# EAGLE design sparkfun-nrf52832-breakout (EAGLE 7.7.0)
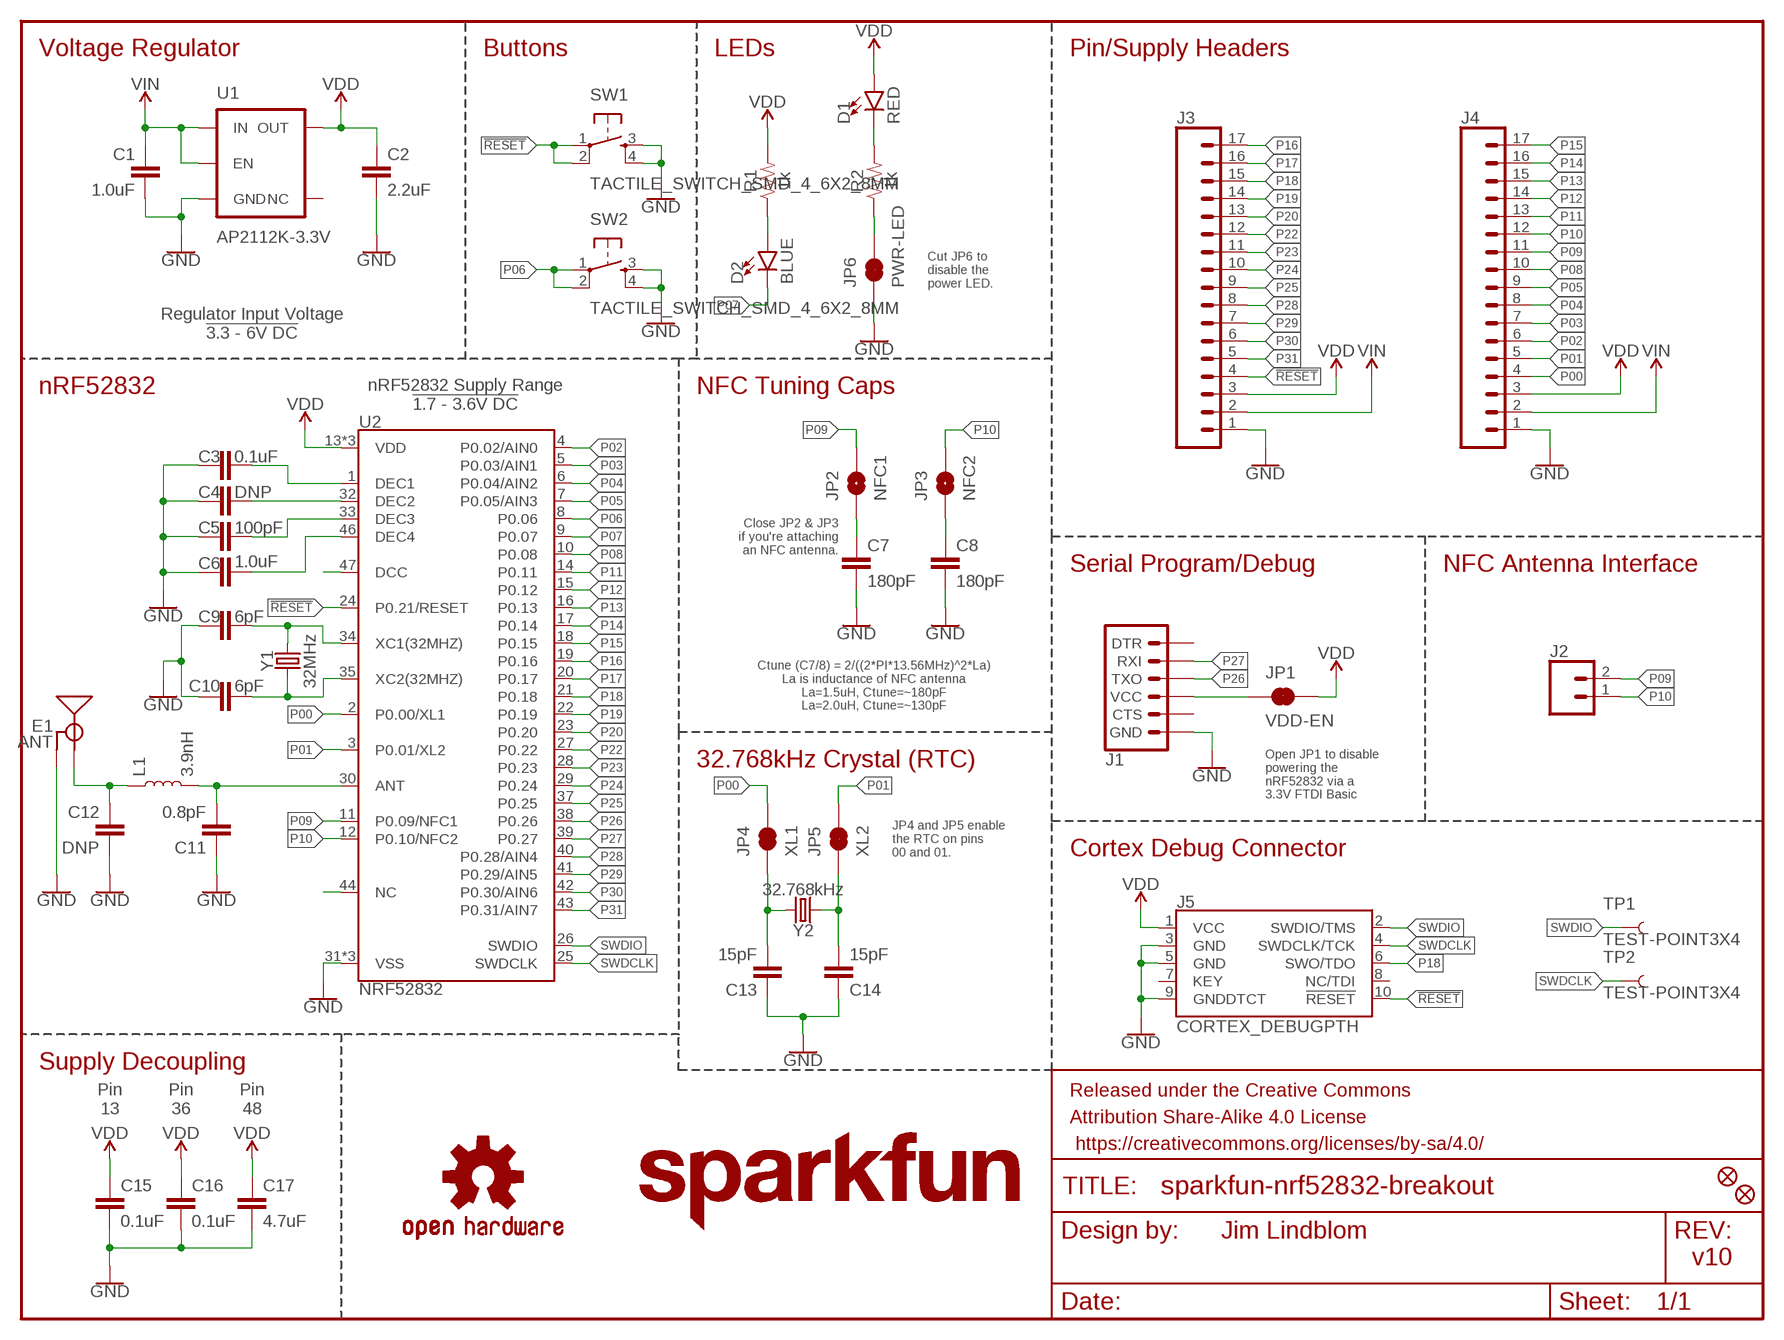
[diagram p0: schematic, sheet 1]

## Parts
C1  1.0uF  1.0UF-0603-16V-10%  [0603]
C2  2.2uF  2.2UF-0603-10V-20%  [0603]
C3  0.1uF  0.1UF-0402-16V-10%  [0402]
C4  DNP  CAP0402  [0402]
C5  100pF  100PF-0402-50V-5%  [0402]
C6  1.0uF  1.0UF-0402-16V-10%  [0402]
C7  180pF  180PF-0603-50V-5%  [0603]
C8  180pF  180PF-0603-50V-5%  [0603]
C9  6pF  6PF-0402-50V-0.5%  [0402]
C10  6pF  6PF-0402-50V-0.5%  [0402]
C11  0.8pF  0.8PF-0402-50V-0.1PF  [0402]
C12  DNP  CAP0402  [0402]
C13  15pF  15PF-0402-50V-5%  [0402]
C14  15pF  15PF-0402-50V-5%  [0402]
C15  0.1uF  0.1UF-0402-16V-10%  [0402]
C16  0.1uF  0.1UF-0402-16V-10%  [0402]
C17  4.7uF  4.7UF0603  [0603]
D1  RED  LED-RED0603  [LED-0603]
D2  BLUE  LED-BLUE0603  [LED-0603]
E1  ANT  ANTENNA-GROUNDEDTRACE-15.2MM  [TRACE_ANTENNA_2.4GHZ_15.2MM]
FD1  FIDUCIALUFIDUCIAL  [FIDUCIAL-MICRO]
FD2  FIDUCIALUFIDUCIAL  [FIDUCIAL-MICRO]
FRAME1  FRAME-LETTER  [CREATIVE_COMMONS]
J1  ARDUINO_SERIAL_PROGRAMPTH  [1X06]
J2  CONN_02PTH  [1X02]
J3  CONN_17  [1X17]
J4  CONN_17  [1X17]
J5  CORTEX_DEBUGPTH  [2X5-PTH-1.27MM]
JP1  VDD-EN  JUMPER-SMT_2_NC_TRACE_SILK  [SMT-JUMPER_2_NC_TRACE_SILK]
JP2  NFC1  JUMPER-SMT_2_NO_SILK  [SMT-JUMPER_2_NO_SILK]
JP3  NFC2  JUMPER-SMT_2_NO_SILK  [SMT-JUMPER_2_NO_SILK]
JP4  XL1  JUMPER-PAD-2-NC_BY_TRACE  [PAD-JUMPER-2-NC_BY_TRACE_YES_SILK]
JP5  XL2  JUMPER-PAD-2-NC_BY_TRACE  [PAD-JUMPER-2-NC_BY_TRACE_YES_SILK]
JP6  PWR-LED  JUMPER-PAD-2-NC_BY_TRACE  [PAD-JUMPER-2-NC_BY_TRACE_YES_SILK]
L1  3.9nH  INDUCTOR-0402-3.9NH  [0402]
LOGO1  OSHW-LOGOMINI  [OSHW-LOGO-MINI]
LOGO2  SFE_LOGO_NAME.1_INCH  [SFE_LOGO_NAME_.1]
LOGO3  SFE_LOGO_NAME.1_INCH  [SFE_LOGO_NAME_.1]
R1  1k  1KOHM-0603-1/10W-1%  [0603]
R2  1k  1KOHM-0603-1/10W-1%  [0603]
SW1  TACTILE_SWITCH_SMD_4_6X2_8MM  SWITCH_SPST_4_PINRECT  [TACTILE_SWITCH_SMD_4.6X2.8MM]
SW2  TACTILE_SWITCH_SMD_4_6X2_8MM  SWITCH_SPST_4_PINRECT  [TACTILE_SWITCH_SMD_4.6X2.8MM]
TP1  TEST-POINT3X4  [PAD.03X.04]
TP2  TEST-POINT3X4  [PAD.03X.04]
U1  AP2112K-3.3V  V_REG_AP2112K-3.3V  [SOT23-5]
U2  NRF52832  [QFN48-6X6MM]
Y1  32MHz  CRYSTAL-32MHZ-SMD-2.0X1.6MM  [CRYSTAL-SMD-2.0X1.6MM]
Y2  32.768kHz  CRYSTAL-32.768KHZSMD-3.2X1.5  [CRYSTAL-SMD-3.2X1.5MM]

## Nets
!RESET!: J3.4 J5.10(!RESET) SW1.1 SW1.2 U2.24(P0.21/RESET)
ANT: C11.2 L1.2 U2.30(ANT)
DCC: U2.47(DCC)
DEC1: C3.2 U2.1(DEC1)
DEC2: C4.2 U2.32(DEC2)
DEC3: C5.2 U2.33(DEC3)
DEC4: C6.2 U2.46(DEC4)
GND: C1.2 C2.2 C3.1 C4.1 C5.1 C6.1 C7.2 C8.2 C9.1 C10.2 C11.1 C12.2 C13.1 C14.1 C15.2 C16.2 C17.2 E1.GND J1.6(GND) J3.1 J4.1 J5.3(GND) J5.5(GND) J5.9(GNDDTCT) JP6.1 SW1.3 SW1.4 SW2.3 SW2.4 U1.2(GND) U2.31(VSS) U2.45(VSS) U2.EP(VSS)
N$1: JP6.2 R2.1
N$3: C13.2 JP4.1 Y2.P$2
N$4: C14.2 JP5.1 Y2.P$1
N$11: C12.1 E1.ANT(SIGNAL) L1.1
N$12: D1.C R2.2
N$14: J1.4(VCC) JP1.1
N$15: D2.A R1.1
NC: U2.44(NC)
NFC1: C7.1 JP2.1
NFC2: C8.1 JP3.1
P00: J4.4 JP4.2 U2.2(P0.00/XL1)
P01: J4.5 JP5.2 U2.3(P0.01/XL2)
P02: J4.6 U2.4(P0.02/AIN0)
P03: J4.7 U2.5(P0.03/AIN1)
P04: J4.8 U2.6(P0.04/AIN2)
P05: J4.9 U2.7(P0.05/AIN3)
P06: SW2.1 SW2.2 U2.8(P0.06)
P07: D2.C U2.9(P0.07)
P08: J4.10 U2.10(P0.08)
P09: J2.2 J4.11 JP2.2 U2.11(P0.09/NFC1)
P10: J2.1 J4.12 JP3.2 U2.12(P0.10/NFC2)
P11: J4.13 U2.14(P0.11)
P12: J4.14 U2.15(P0.12)
P13: J4.15 U2.16(P0.13)
P14: J4.16 U2.17(P0.14)
P15: J4.17 U2.18(P0.15)
P16: J3.17 U2.19(P0.16)
P17: J3.16 U2.20(P0.17)
P18: J3.15 J5.6(SWO/TDO) U2.21(P0.18)
P19: J3.14 U2.22(P0.19)
P20: J3.13 U2.23(P0.20)
P22: J3.12 U2.27(P0.22)
P23: J3.11 U2.28(P0.23)
P24: J3.10 U2.29(P0.24)
P25: J3.9 U2.37(P0.25)
P26: J1.3(TXO) U2.38(P0.26)
P27: J1.2(RXI) U2.39(P0.27)
P28: J3.8 U2.40(P0.28/AIN4)
P29: J3.7 U2.41(P0.29/AIN5)
P30: J3.6 U2.42(P0.30/AIN6)
P31: J3.5 U2.43(P0.31/AIN7)
SWDCLK: J5.4(SWDCLK/TCK) TP2.P$1 U2.25(SWDCLK)
SWDIO: J5.2(SWDIO/TMS) TP1.P$1 U2.26(SWDIO)
VDD: C2.1 C15.1 C16.1 C17.1 D1.A J3.3 J4.3 J5.1(VCC) JP1.2 R1.2 U1.5(OUT) U2.13(VDD) U2.36(VDD) U2.48(VDD)
VIN: C1.1 J3.2 J4.2 U1.1(IN) U1.3(EN)
XC1: C9.2 U2.34(XC1(32MHZ)) Y1.3
XC2: C10.1 U2.35(XC2(32MHZ)) Y1.1
Unconnected: J1.1(DTR) J1.5(CTS) J5.7(KEY) J5.8(NC/TDI) U1.4(NC)

## Notes on the sheet
- Voltage Regulator | Buttons | LEDs | Pin/Supply Headers
- Cut JP6 to
  disable the
  power LED.
- Regulator Input Voltage
  !3.3 - 6V DC!
- nRF52832
- nRF52832 Supply Range
  !1.7 - 3.6V DC!
- NFC Tuning Caps
- Close JP2 & JP3
  if you're attaching
  an NFC antenna.
- Serial Program/Debug | NFC Antenna Interface
- Ctune (C7/8) = 2/((2*PI*13.56MHz)^2*La)
  La is inductance of NFC antenna
  La=1.5uH, Ctune=~180pF
  La=2.0uH, Ctune=~130pF
- Open JP1 to disable 
  powering the 
  nRF52832 via a
  3.3V FTDI Basic
- 32.768kHz Crystal (RTC)
- JP4 and JP5 enable
  the RTC on pins
  00 and 01.
- Cortex Debug Connector
- Supply Decoupling
- Pin
  13
- Pin
  36
- Pin
  48
- Jim Lindblom
- v10

## Library data of the parts
C1 = SparkFun-Capacitors:1.0UF: 1µF ceramic capacitors A capacitor is a passive two-terminal electrical component used to store electrical energy temporarily in an electric field.; PROD_ID: CAP-00868
C2 = SparkFun-Capacitors:2.2UF: 2.2µF ceramic capacitors A capacitor is a passive two-terminal electrical component used to store electrical energy temporarily in an electric field.; PROD_ID: CAP-07888
C3 C15 C16 = SparkFun-Capacitors:0.1UF: 0.1µF ceramic capacitors A capacitor is a passive two-terminal electrical component used to store electrical energy temporarily in an electric field.; PROD_ID: CAP-12416
C4 C12 = SparkFun-Passives:CAP: Capacitor Standard 0603 ceramic capacitor, and 0.1" leaded capacitor.
C5 = nrf52832-breakout-temp:100PF: 100pF/0.1nF ceramic capacitors A capacitor is a passive two-terminal electrical component used to store electrical energy temporarily in an electric field.; PROD_ID: CAP-13458
C6 = SparkFun-Capacitors:1.0UF: 1µF ceramic capacitors A capacitor is a passive two-terminal electrical component used to store electrical energy temporarily in an electric field.; PROD_ID: CAP-12417
C7 C8 = nrf52832-breakout-temp:180PF: 180pF/0.18nF ceramic capacitors A capacitor is a passive two-terminal electrical component used to store electrical energy temporarily in an electric field.; PROD_ID: CAP-11661
C9 C10 = nrf52832-breakout-temp:6PF: 15pF ceramic capacitors A capacitor is a passive two-terminal electrical component used to store electrical energy temporarily in an electric field.; PROD_ID: CAP-13455
C11 = nrf52832-breakout-temp:0.8PF: 0.8pF ceramic capacitors A capacitor is a passive two-terminal electrical component used to store electrical energy temporarily in an electric field.; PROD_ID: CAP-13456
C13 C14 = SparkFun-Capacitors:15PF: 15pF ceramic capacitors A capacitor is a passive two-terminal electrical component used to store electrical energy temporarily in an electric field.; PROD_ID: CAP-13063
C17 = SparkFun-Capacitors:4.7UF: 4.7µF ceramic capacitors A capacitor is a passive two-terminal electrical component used to store electrical energy temporarily in an electric field.; PROD_ID: CAP-08280
D1 = SparkFun-LED:LED-RED: Red SMD LED Used in manufacturing of most products at SparkFun Packages: 0603 - SMD 0603 package [Product Link] <http://docs.avagotech.com/docs/AV02-0551EN> 0603 SMART - SMD 0603 SMART package ( more efficient and expensive)[Product Link] <http://www.osram-os.com/Graphics/XPic2/00077099_0.pdf> 1206 - SMD1206 package [Product Link] <https://www.sparkfun.com/datasheets/DevTools/LilyPad/Q150OVS4.pdff> SparkFun Products: Pro Mini 328 -5V <https://www.sparkfun.com/products/821> RedBoard <https://www.sparkfun.com/products/12757> IOIO-OTG <https://www.sparkfun.com/products/13613>; PROD_ID: DIO-00819
D2 = SparkFun-LED:LED-BLUE: Blue SMD LED Used in manufacturing of various products at SparkFun Packages: 0603 - SMD 0603 package [Product Link] <http://www.digikey.com/product-detail/en/SMLE12BC7TT86/511-1589-2-ND/1641808> 1206 - SMD1206 package [Product Link] <http://www.digikey.com/product-detail/en/lite-on-inc/LTST-C150TBKT/160-1643-1-ND/573584> SparkFun Products: ESP8266 Thing-Dev Board <https://www.sparkfun.com/products/13711> RedBoard <https://www.sparkfun.com/products/12757>; PROD_ID: DIO-08575
E1 = SparkFun-RF:ANTENNA-GROUNDED: Antenna w/ Ground Connection 2.4GHz antennae with signal and ground terminals. TRACE_ANTENNA_2.4GHZ_15.2MM - Meander Trace antenna 15.2 x 5.7mm footprint Based on layout from TI app note AN043 <http://www.ti.com/lit/an/swra117d/swra117d.pdf>. TRACE_ANTENNA_2.4GHZ_25.7MM - Inverted F trace antenna 25.7 x 7.5 mm footprint. Based on layout from TI design note DN0007 <http://www.ti.com/lit/an/swru120b/swru120b.pdf>.
FD1 FD2 = SparkFun-Aesthetics:FIDUCIAL: Fiducial Alignment Points Point-of-reference for pick-and-place machines and other optical instruments.
FRAME1 = SparkFun-Aesthetics:FRAME-LETTER: Schematic Frame Standard 8.5x11 US Letter frame
J1 = SparkFun-Connectors:ARDUINO_SERIAL_PROGRAM: FTDI connector footprints
J2 = SparkFun-Connectors:CONN_02: Multi connection point. Often used as Generic Header-pin footprint for 0.1 inch spaced/style header connections On any of the 0.1 inch spaced packages, you can populate with these: Break Away Headers - Straight <https://www.sparkfun.com/products/116> (PRT-00116) Break Away Male Headers - Right Angle <https://www.sparkfun.com/products/553> (PRT-00553) Female Headers <https://www.sparkfun.com/products/115> (PRT-00115) Break Away Headers - Machine Pin <https://www.sparkfun.com/products/117> (PRT-00117) Break Away Female Headers - Swiss Machine Pin <https://www.sparkfun.com/products/743> (PRT-00743) For SCREWTERMINALS and SPRING TERMINALS visit here: Screw Terimnals on SparkFun.com <https://www.sparkfun.com/search/results?term=Screw+Terminals> (5mm/3.5mm/2.54mm spacing) This device is also useful as a general connection point to wire up your design to another part of your project. Our various solder wires solder well into these plated through hole pads. Hook-Up Wire - Assortment (Stranded, 22 AWG) <https://www.sparkfun.com/products/11375> (PRT-11375) Hook-Up Wire - Assortment (Solid Core, 22 AWG) <https://www.sparkfun.com/products/11367> (PRT-11367) View the entire wire category on our website here <https://www.sparkfun.com/categories/141> Special notes: Molex polarized connector foot print use with: PRT-08233 with associated crimp pins and housings. 2.54_SCREWTERM for use with PRT-10571. 3.5mm Screw Terminal footprints for PRT-08084 5mm Screw Terminal footprints for use with PRT-08432
J3 J4 = SparkFun-Connectors:CONN_17: 1x17 .1" header
J5 = SparkFun-Connectors:CORTEX_DEBUG: Cortex Debug Connector Datasheet <http://infocenter.arm.com/help/topic/com.arm.doc.faqs/attached/13634/cortex_debug_connectors.pdf>
JP1 = SparkFun-Jumpers:JUMPER-SMT_2_NC_TRACE: Normally closed trace jumper This jumper has a trace between two pads so it's normally closed (NC). Use a razor knife to open the connection. For best results follow the IPC guidelines for cutting traces: Cutout at least 0.063 mm (0.005 in). Remove all loose material to clean up the cut area. Seal the cut with an approved epoxy. Reapply solder to reclose the connection.
JP2 JP3 = SparkFun-Jumpers:JUMPER-SMT_2_NO: Normally open jumper This jumper has two pads in close proximity to each other. Apply solder to close the connection. Round pads are easier to solder for beginners, but are a lot larger. SparkFun Product that uses the round pads: SparkFun EL Sequencer <https://www.sparkfun.com/products/12781>
JP4-JP6 = SparkFun-Jumpers:JUMPER-PAD-2-NC_BY_TRACE
L1 = nrf52832-breakout-temp:INDUCTOR: Inductors Resist changes in electrical current. Basically a coil of wire. SparkFun Products: SparkFun Load Cell Amplifier - HX711 <https://www.sparkfun.com/products/13879> IOIO-OTG - V2.2 <https://www.sparkfun.com/products/13613>; PROD_ID: NDUC-13457
LOGO1 = SparkFun-Aesthetics:OSHW-LOGO: Open-Source Hardware (OSHW) Logo This logo indicates the piece of hardware it is found on incorporates a OSHW license and/or adheres to the definition of open source hardware found here: http://freedomdefined.org/OSHW
LOGO2 LOGO3 = SparkFun-Aesthetics:SFE_LOGO_NAME: SparkFun Font Logo This is the SparkFun name logo. The logo on the schematic will always be the same size; the package variant is the height of the flame part of the logo (or the height the flame would be, if it were drawn). Default layer for the logo on the board is tSilk.
R1 R2 = SparkFun-Resistors:1KOHM: 1kΩ resistor A resistor is a passive two-terminal electrical component that implements electrical resistance as a circuit element. Resistors act to reduce current flow, and, at the same time, act to lower voltage levels within circuits.; PROD_ID: RES-07856
SW1 SW2 = SparkFun-Electromechanical:SWITCH_SPST_4_PIN; PROD_ID: SWCH-13065
TP1 TP2 = SparkFun-Connectors:TEST-POINT: Bare copper test points for troubleshooting or ICT
U1 = SparkFun-PowerIC:V_REG_AP2112: AP2112 - 600mA CMOS LDO Regulator w/ Enable The AP2112 is CMOS process low dropout linear regulator with enable function, the regulator delivers a guaranteed 600mA (min.) continuous load current. Features Output Voltage Accuracy: ±1.5% Output Current: 600mA (Min.) Foldback Short Current Protection: 50mA Enable Function to Turn ON/OFF VOUT Low Dropout Voltage (3.3V): 250mV (Typ.) @IOUT=600mA Excellent Load Regulation: 0.2%/A (Typ.) Excellent Line Regulation: 0.02%/V (Typ.) Low Quiescent Current: 55μA (Typ.) Low Standby Current: 0.01μA (Typ.) Low Output Noise: 50μVRMS PSRR: 100Hz -65dB, 1kHz -65dB OTSD Protection Stable with 1.0μF Flexible Cap: Ceramic, Tantalum and Aluminum Electrolytic Operation Temperature Range: -40°C to 85°C ESD: MM 400V, HBM 4000V; PROD_ID: VREG-12457; VALUE: 3.3V
U2 = nrf52832-breakout-temp:NRF52832: Nordic nRF52832 Bluetooth Smart/ANT/2.4GHz RF SoC The nRF52832 SoC is a powerful, highly flexible ultra-low power multiprotocol SoC ideally suited for Bluetooth® Smart ANT and 2.4GHz ultra low-power wireless applications. The nRF52832 SoC is built around a 32-bit ARM® Cortex™-M4F CPU with 512kB + 64kB RAM. The embedded 2.4GHz transceiver supports Bluetooth Smart, ANT and proprietary 2.4 GHz protocol stack. It is on air compatible with the nRF51 Series, nRF24L and nRF24AP Series products from Nordic Semiconductor. Product Page <https://www.nordicsemi.com/eng/Products/Bluetooth-low-energy2/nRF52832>; PROD_ID: IC-13460
Y1 = nrf52832-breakout-temp:CRYSTAL-32MHZ: 32MHz Crystal Digikey Example <http://www.digikey.com/product-detail/en/murata-electronics-north-america/XRCGB32M000F2P00R0/490-9769-1-ND/4952013> Frequency: 32MHz Frequency Stability: ±20ppm Frequency Tolerance: ±20ppm Load Capacitance: 6pF; PROD_ID: XTAL-13459
Y2 = SparkFun-Clocks:CRYSTAL-32.768KHZ: 32.768kHz Crystal Frequency: 32.768kHz Frequency Stability: ±20ppm Load Capacitance: 12.5pF (PTH-2X6 & SMD-3.2X1.5), 6pF (SMD-2X6); PROD_ID: XTAL-13062

## Board
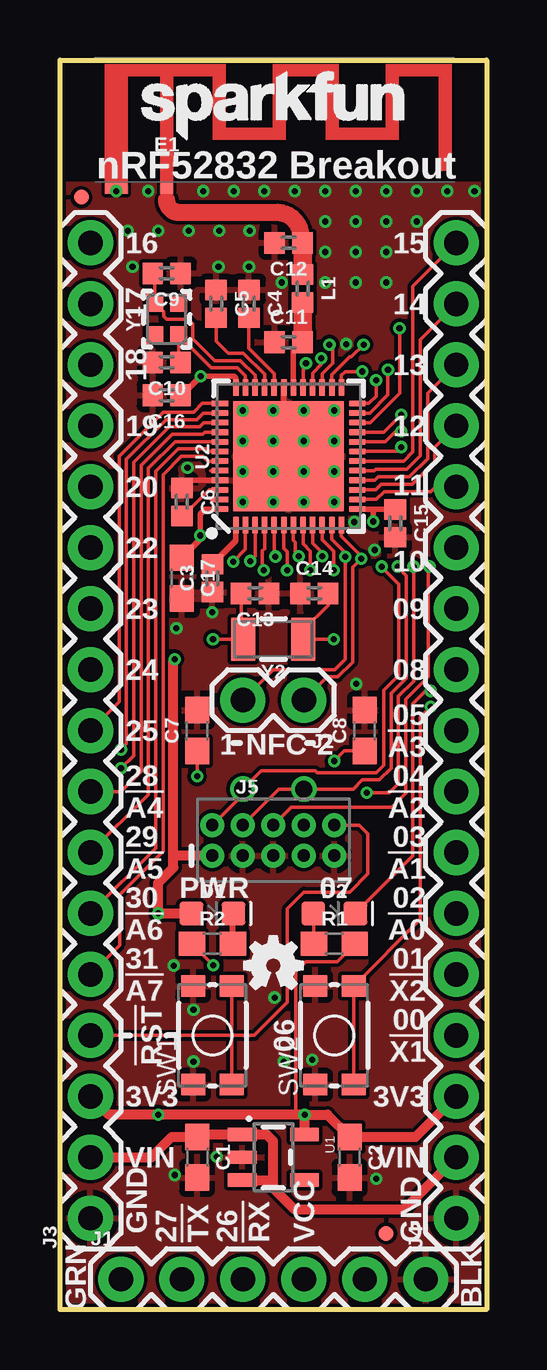
[diagram p1: board, top side]
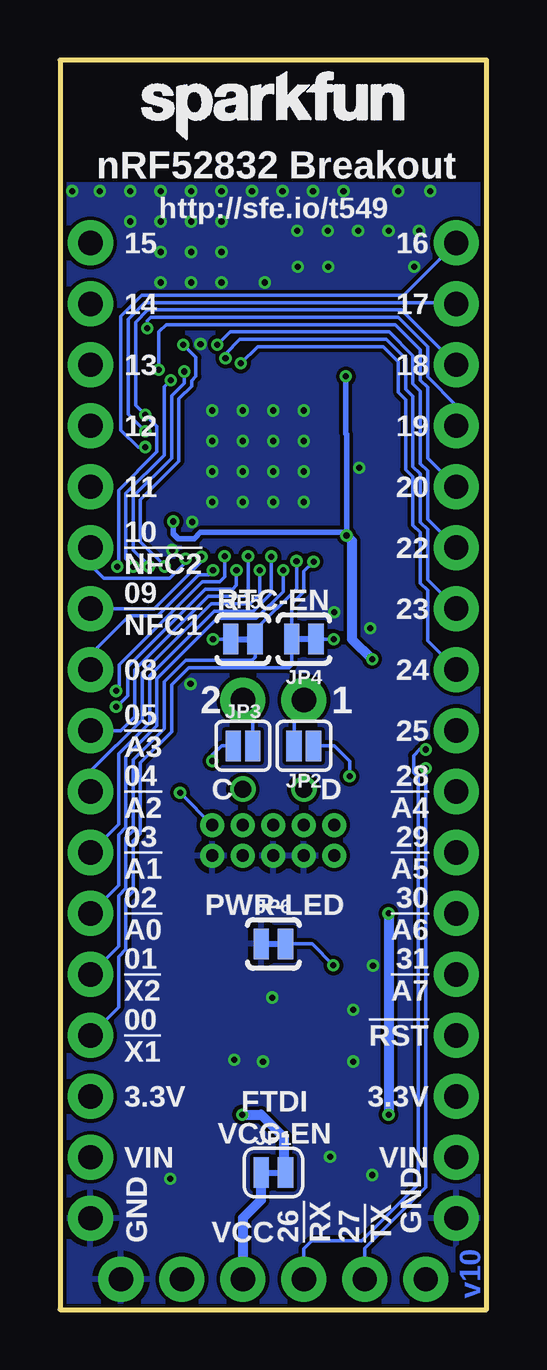
[diagram p2: board, bottom side, seen from below]

Size 17.78 x 52.07 mm. Coordinates in mm from the lower left corner, seen from the top.
Outline: 0,0 0,52.07 17.78,52.07 17.78,0 0,0
Copper layers (1*16): Top 0.035mm / dielectric 1.5mm / Bottom 0.035mm
Design rules "SparkFun-2-layer-FAB-LIMIT *": minimum track width 4mil, minimum drill 6mil, track to track 6mil, track to pad 6mil, pad to pad 6mil, via to via 6mil, smd to smd 6mil, copper to edge 4mil, drill to drill 4mil, minimum pad ring 5mil, minimum via ring 5mil, stop-mask expansion 4mil, vias tented up to drill 25mil, thermal gap 10mil
tRestrict: 2 lines

### Footprints (pad centres in the part's own frame; a part is rotated, then mirrored left to right if it is on the bottom)
0603 = smd 1.1 x 1: 1 -0.85,0; 2 0.85,0
0402 = smd 0.85 x 0.9: 1 -0.58,0; 2 0.58,0
LED-0603 = smd 1 x 1: A -0.877,0; C 0.877,0
TRACE_ANTENNA_2.4GHZ_15.2MM = smd 0.5 x 0.5: ANT 0,-0.25 | smd 0.9 x 0.5: GND -2.1,-0.25
FIDUCIAL-MICRO = smd 0.635 x 0.635: 1 0,0
1X06 = drill 1.016 pad 1.88: 1 0,0; 2 2.54,0; 3 5.08,0; 4 7.62,0; 5 10.16,0; 6 12.7,0
1X02 = drill 1.016 pad 1.88: 1 0,0; 2 2.54,0
1X17 = drill 1.016 pad 1.88: 1 0,0; 2 2.54,0; 3 5.08,0; 4 7.62,0; 5 10.16,0; 6 12.7,0; 7 15.24,0; 8 17.78,0; 9 20.32,0; 10 22.86,0; 11 25.4,0; 12 27.94,0; 13 30.48,0; 14 33.02,0; 15 35.56,0; 16 38.1,0; 17 40.64,0
2X5-PTH-1.27MM = drill 0.508 pad 1: 1 -2.54,-0.635; 2 -2.54,0.635; 3 -1.27,-0.635; 4 -1.27,0.635; 5 0,-0.635; 6 0,0.635; 7 1.27,-0.635; 8 1.27,0.635; 9 2.54,-0.635; 10 2.54,0.635
SMT-JUMPER_2_NC_TRACE_SILK = smd 0.635 x 1.27: 1 -0.508,0; 2 0.508,0
SMT-JUMPER_2_NO_SILK = smd 0.635 x 1.27: 1 -0.406,0; 2 0.406,0
PAD-JUMPER-2-NC_BY_TRACE_YES_SILK = smd 0.635 x 1.27: 1 -0.508,0; 2 0.508,0
TACTILE_SWITCH_SMD_4.6X2.8MM = smd 0.9 x 1: 1 -2.05,-0.8; 2 2.05,-0.8; 3 2.05,0.8; 4 -2.05,0.8
PAD.03X.04 = smd 1.016 x 1.016: P$1 0,0
SOT23-5 = smd 0.55 x 1.2: 1 -0.95,-1.3; 2 0,-1.3; 3 0.95,-1.3; 4 0.95,1.3; 5 -0.95,1.3
QFN48-6X6MM = smd 0.68 x 0.23: 1 -2.86,2.2; 2 -2.86,1.8; 3 -2.86,1.4; 4 -2.86,1; 5 -2.86,0.6; 6 -2.86,0.2; 7 -2.86,-0.2; 8 -2.86,-0.6; 9 -2.86,-1; 10 -2.86,-1.4; 11 -2.86,-1.8; 12 -2.86,-2.2; 25 2.86,-2.2; 26 2.86,-1.8; 27 2.86,-1.4; 28 2.86,-1; 29 2.86,-0.6; 30 2.86,-0.2; 31 2.86,0.2; 32 2.86,0.6; 33 2.86,1; 34 2.86,1.4; 35 2.86,1.8; 36 2.86,2.2 | smd 0.23 x 0.68: 13 -2.2,-2.86; 14 -1.8,-2.86; 15 -1.4,-2.86; 16 -1,-2.86; 17 -0.6,-2.86; 18 -0.2,-2.86; 19 0.2,-2.86; 20 0.6,-2.86; 21 1,-2.86; 22 1.4,-2.86; 23 1.8,-2.86; 24 2.2,-2.86; 37 2.2,2.86; 38 1.8,2.86; 39 1.4,2.86; 40 1,2.86; 41 0.6,2.86; 42 0.2,2.86; 43 -0.2,2.86; 44 -0.6,2.86; 45 -1,2.86; 46 -1.4,2.86; 47 -1.8,2.86; 48 -2.2,2.86 | smd 4.6 x 4.6: EP 0,0
CRYSTAL-SMD-2.0X1.6MM = smd 0.75 x 0.7: 1 -0.675,-0.5; 2 0.675,-0.5; 3 0.675,0.5; 4 -0.675,0.5
CRYSTAL-SMD-3.2X1.5MM = smd 1 x 1.8: P$1 -1.25,0; P$2 1.25,0

### Placement (x,y rotation side)
C1  5.71,6.35 270 top
C2  12.06,6.35 270 top
C3  6.35,30.48 90 top
C4  7.87,41.91 270 top
C5  6.5,41.91 270 top
C6  5.08,33.66 270 top
C7  5.71,24.13 90 top
C8  12.7,24.13 90 top
C9  4.45,43.18 180 top
C10  4.45,39.47 180 top
C11  9.53,40.31 0 top
C12  9.53,44.45 180 top
C13  8.13,29.84 180 top
C14  10.59,29.84 0 top
C15  13.97,32.77 270 top
C16  4.45,38.1 180 top
C17  5.08,30.48 270 top
D1  6.35,16.51 0 top
D2  11.43,16.51 0 top
E1  4.45,46.99 0 top
FD1  13.59,3.17 0 top
FD2  0.89,46.35 0 top
FRAME1  -10.16,-17.78 0 top  (outside the outline)
J1  2.54,1.27 0 top
J2  10.16,25.4 180 top
J3  1.27,3.81 90 top
J4  16.51,3.81 90 top
J5  8.89,19.56 0 top
JP1  8.89,5.71 0 bottom
JP2  7.62,23.5 180 bottom
JP3  10.16,23.5 0 bottom
JP4  7.62,27.94 180 bottom
JP5  10.16,27.94 0 bottom
JP6  8.89,15.24 0 bottom
L1  10.11,42.55 270 top
LOGO1  8.89,14.35 0 top
LOGO2  2.92,48.26 0 top
LOGO3  14.86,48.26 0 bottom
R1  11.43,15.24 0 top
R2  6.35,15.24 0 top
SW1  6.35,11.43 90 top
SW2  11.43,11.43 90 top
TP1  7.62,21.69 0 bottom
TP2  10.16,21.69 0 bottom
U1  8.89,6.35 270 top
U2  9.53,35.56 90 top
Y1  4.45,41.27 90 top
Y2  8.89,27.94 180 top

### Tracks (layer width: path | path; a pad name or v marks a point on that pad's centre or on a via)
!RESET!  (via drill 0.25)
  Top 0.152: U2.24 12.87,37.76 13.17,38.06 v13.17,38.72 | SW1.1 7.15,11.43 | 7.15,11.43 SW1.2 | J3.4 7.15,11.43 | 7.15,11.43 8.1,11.43 9.47,12.8 9.47,16.71 10.16,17.4 12.06,17.4 12.83,18.16 12.83,19.84 12.47,20.19 J5.10 | v14.73,30.96 14.73,26.19 14.1,25.55 14.1,21.92 13.72,21.54 v12.78,21.54
  Bottom 0.152: v13.17,38.72 13.44,38.46 13.44,35.61 15.04,34.01 15.04,31.29 14.73,30.99 v14.73,30.96 | J5.10 v12.78,21.54
ANT
  Top 0.229: U2.30 9.72,39.93 C11.2
  Top 0.762: C11.2 L1.2
DCC
  Top 0.152: U2.47 6.27,33.76
DEC1
  Top 0.229: U2.1 7.33,32.03 C3.2
DEC2
  Top 0.152: U2.32 8.93,39.01 7.87,40.06 C4.2
DEC3
  Top 0.152: U2.33 8.53,38.97 7.64,39.85 7.01,39.85 6.5,40.36 C5.2
DEC4
  Top 0.152: C6.2 5.13,33.08 6.22,34.16 U2.46
GND  (via drill 0.25)
  Top 0.152: 9.32,35.76 v8.89,36.2
  Top 0.229: U2.31 9.32,35.76 U2.EP | C16.2 3.81,38.1 | U2.45 5.41,34.56 C6.1
  other vias: 2.35,46.61 3.02,43.46 6.6,43.46 7.87,43.46 9.25,42.8 11.05,42.8 6.35,29.06 12.27,32.82 13.11,31.65 10.16,34.92 10.16,33.66 10.16,36.2 10.16,37.47 8.89,37.47 8.89,34.92 8.89,33.66 7.62,33.66 7.62,34.92 7.62,36.2 7.62,37.47 11.43,37.47 11.43,36.2 11.43,34.92 11.43,33.66 5.31,35.08 11.93,40.23 4.85,28.4 4.78,5.61 6.53,6.38 10.52,10.41 5.56,10.34 4.74,14.34 5.56,12.5 12.34,26.07 13.18,5.46 11.05,44.07 11.05,45.34 11.05,46.61 9.78,46.61 8.51,46.61 7.24,46.61 5.97,46.61 7.9,44.96 6.63,44.96 5.36,44.96 3.68,46.61 12.32,42.8 12.32,44.07 12.32,45.34 12.32,46.61 13.59,46.61 14.86,46.61 16.13,46.61 17.27,46.61 4.09,44.96 2.82,44.96 13.59,42.8 13.59,44.07 13.59,45.34 14.86,45.34 9.32,10.34 8.94,13
  pour Top (isolate 0.152): 17.78,46.86 0,46.86 0,0 17.78,0
  pour Bottom (isolate 0.152): 17.78,46.86 0,46.86 0,0 17.78,0
N$1  (via drill 0.25)
  Top 0.152: R2.1 v6.39,14.35
  Bottom 0.152: v6.39,14.35 7.28,15.24 JP6.2
N$3  (via drill 0.25)
  Top 0.152: v6.38,27.94 Y2.P$2 7.55,28.03 C13.2
  Bottom 0.152: JP4.1 v6.38,27.94
N$4  (via drill 0.25)
  Top 0.152: C14.2 11.17,29.36 10.14,28.33 10.53,27.94 | 10.53,27.94 v11.4,27.94 | 10.53,27.94 Y2.P$1
  Bottom 0.152: JP5.1 v11.4,27.94
N$11
  Top 0.508: E1.ANT 4.45,46.23
  Top 0.711: 4.45,46.23 arc90 4.95,45.72 9.02,45.72 arc-90 10.05,44.69 10.05,44.45 C12.1
  Top 0.762: L1.1 C12.1
N$12
  Top 0.254: R2.2 7.2,16.48 D1.C
N$14
  Bottom 0.406: J1.4 10.16,3.81 9.4,4.57 JP1.1
N$15
  Top 0.152: R1.1 10.58,16.48 D2.A
NC
  Top 0.152: U2.44 6.27,34.96
NFC1  (via drill 0.25)
  Top 0.152: 5.94,23.44 5.78,23.28 C7.1 v5.71,22.23
  Bottom 0.152: v5.71,22.23 5.71,22.86 6.35,23.5 JP2.1
NFC2  (via drill 0.25)
  Top 0.152: C8.1 11.85,23.28 v11.43,22.86
  Bottom 0.152: JP3.1 11.05,23.5 11.43,23.11 v11.43,22.86
P00  (via drill 0.25)
  Top 0.152: U2.2 7.72,31.68 v7.21,31.17
  Bottom 0.152: v7.21,31.17 7.62,30.76 7.62,29.92 8.13,29.41 JP4.2 | JP4.2 8.2,27.94 | JP4.2 8.13,26.85 8.23,26.75 12.42,26.75 13.13,26.04 13.13,24.08 14.43,22.78 14.43,19.84 14.73,19.53 14.73,17.42 15.04,17.12 15.04,15.01 15.34,14.71 15.34,12.6 J4.4
P01  (via drill 0.25)
  Top 0.152: U2.3 8.12,31.39 v7.92,31.19
  Bottom 0.152: v7.92,31.19 7.92,30.05 9.65,28.32 JP5.2 9.65,27.18 9.78,27.05 12.55,27.05 13.44,26.16 13.44,24.21 14.73,22.91 14.73,19.96 15.04,19.66 15.04,17.55 15.34,17.25 15.34,15.14 J4.5
P02  (via drill 0.25)
  Top 0.152: U2.4 8.53,31.71 8.43,31.62 8.43,30.86 v8.48,30.81
  Bottom 0.152: v8.48,30.81 8.48,29.92 9.6,28.8 11.23,28.8 13.74,26.29 13.74,24.33 15.04,23.04 15.04,20.09 15.34,19.79 15.34,17.68 J4.6
P03  (via drill 0.25)
  Top 0.152: U2.5 8.93,31.43 v8.98,31.38
  Bottom 0.152: v8.98,31.38 8.98,29.86 9.73,29.11 11.35,29.11 14.05,26.42 14.05,24.46 15.34,23.16 15.34,20.22 J4.7
P04  (via drill 0.25)
  Top 0.152: U2.6 9.32,31.72 9.46,31.59 v9.46,30.81
  Bottom 0.152: v9.46,30.81 9.46,29.81 9.86,29.41 11.48,29.41 14.35,26.54 14.35,24.59 16.51,22.43 J4.8
P05  (via drill 0.25)
  Top 0.152: U2.7 9.72,32.06 9.8,31.98 9.8,31.53 v9.94,31.39
  Bottom 0.152: v9.94,31.39 9.94,29.88 10.11,29.72 11.61,29.72 14.66,26.67 14.66,24.71 15.24,24.13 J4.9
P06  (via drill 0.25)
  Top 0.152: U2.8 10.12,31.91 10.43,31.61 v10.43,30.81 | v15.44,25.12 15.01,24.69 15.01,16.26 SW2.2 SW2.1
  Bottom 0.152: v10.43,30.81 10.43,30.19 10.59,30.02 11.73,30.02 14.96,26.8 14.96,25.58 15.42,25.12 v15.44,25.12
P07  (via drill 0.25)
  Top 0.152: U2.9 10.53,31.94 10.92,31.55 v10.92,31.39 | v15.44,25.78 15.24,25.78 14.71,25.25 14.71,18.91 D2.C
  Bottom 0.152: v10.92,31.39 10.92,30.53 11.12,30.33 11.86,30.33 15.32,26.87 15.32,25.91 v15.44,25.78
P08  (via drill 0.25)
  Top 0.152: U2.10 10.93,32.08 11.4,31.6 v11.4,30.81
  Bottom 0.152: v11.4,30.81 11.58,30.63 11.99,30.63 13.72,28.91 14.88,28.91 16.51,27.28 J4.10
P09  (via drill 0.25)
  Top 0.152: U2.11 11.32,32.11 11.89,31.55 v11.89,31.37 11.89,27.1 11.46,26.67 8.89,26.67 J2.2
  Bottom 0.152: v11.89,31.37 11.89,31.17 13.84,29.21 J4.11 | JP2.2 8.03,24.99 J2.2
P10  (via drill 0.25)
  Top 0.152: U2.12 11.72,32.22 12.55,31.39 v12.55,31.29 12.19,30.94 12.19,26.98 11.58,26.36 11.12,26.36 J2.1
  Bottom 0.152: 16.51,31.62 J4.12 16.51,31.04 15.95,30.48 13.21,30.48 12.55,31.14 v12.55,31.29 | JP3.2 9.75,24.99 J2.1
P11
  Top 0.152: U2.14 13.19,33.76 13.51,34.09 15.44,34.09 15.65,34.29 J4.13
P12
  Top 0.152: U2.15 13.15,34.16 13.39,34.39 14.68,34.39 15.62,35.33 15.62,35.94 J4.14
P13
  Top 0.152: U2.16 13.12,34.56 13.26,34.7 14.55,34.7 15.32,35.46 15.32,38.18 J4.15
P14
  Top 0.152: U2.17 13.09,34.96 13.16,35.03 14.45,35.03 15.01,35.59 15.01,40.41 J4.16
P15
  Top 0.152: J4.17 14.71,42.65 14.71,35.74 14.33,35.36 U2.18
P16  (via drill 0.25)
  Top 0.152: U2.19 14.04,35.76 v14.22,35.94
  Bottom 0.152: J3.17 3.45,42.27 14.38,42.27 15.24,41.4 15.24,36.65 14.53,35.94 v14.22,35.94
P17  (via drill 0.25)
  Top 0.152: U2.20 13.55,36.16 13.99,36.6 v14.22,36.6
  Bottom 0.152: J3.16 1.32,41.96 14.25,41.96 14.94,41.27 14.94,37.31 v14.22,36.6
P18  (via drill 0.25)
  Top 0.152: U2.21 13.5,36.56 v14.22,37.29 | v15.39,30.96 15.34,30.91 15.34,26.36 14.4,25.43 14.4,21.51 13.82,20.93 9.63,20.93 J5.6
  Bottom 0.152: J3.15 3.56,41.66 14.12,41.66 14.63,41.15 14.63,37.69 v14.22,37.29 13.74,36.8 13.74,35.74 15.34,34.14 15.34,31.01 v15.39,30.96
P19  (via drill 0.25)
  Top 0.152: U2.22 12.93,36.96 14.15,38.18 v14.15,40.89
  Bottom 0.152: v14.15,40.89 14.15,41.2 13.99,41.35 3.68,41.35 2.46,40.13 2.46,38.86 1.27,37.67 J3.14
P20  (via drill 0.25)
  Top 0.152: U2.23 12.9,37.36 13.66,38.12 v13.66,39.17
  Bottom 0.152: v13.66,39.17 13.66,40.74 13.36,41.05 3.81,41.05 2.77,40.01 2.77,38.73 2.46,38.43 2.46,35.48 J3.13
P22  (via drill 0.25)
  Top 0.152: U2.27 10.93,38.99 11.37,39.43 11.37,40.07 v11.23,40.21
  Bottom 0.152: 11.18,40.26 v11.23,40.21 10.69,40.74 4.06,40.74 3.07,39.75 3.07,38.58 2.77,38.28 2.77,35.26 2.46,34.95 2.46,32.94 J3.12
P23  (via drill 0.25)
  Top 0.152: U2.28 10.53,39.02 10.88,39.38 v10.88,39.64
  Bottom 0.152: J3.11 2.46,30.4 2.46,32.51 2.77,32.82 2.77,34.82 3.07,35.13 3.07,38.05 3.38,38.35 3.38,39.62 4.19,40.44 10.29,40.44 10.88,39.84 v10.88,39.64
P24  (via drill 0.25)
  Top 0.152: U2.29 10.12,39.31 v10.25,39.43
  Bottom 0.152: J3.10 2.46,27.86 2.46,29.97 2.77,30.28 2.77,32.38 3.07,32.69 3.07,34.7 3.38,35 3.38,37.92 3.68,38.23 3.68,39.5 4.32,40.13 9.55,40.13 v10.25,39.43
P25
  Top 0.152: U2.37 5.93,37.76 5.56,37.39 4.29,37.39 2.46,35.56 2.46,25.32 J3.9
P26  (via drill 0.25)
  Top 0.152: U2.38 5.97,37.36 5.69,37.08 4.42,37.08 2.77,35.43 2.77,23.57 v2.54,23.34
  Bottom 0.152: v2.54,23.34 2.79,23.34 3.05,23.09 3.05,22.38 2.85,22.17 2.85,5.23 5.21,2.87 7.29,2.87 7.62,2.54 J1.3
P27  (via drill 0.25)
  Top 0.152: U2.39 6,36.96 5.82,36.78 4.55,36.78 3.07,35.31 3.07,23.09 v2.54,22.55
  Bottom 0.152: v2.54,22.55 2.54,5.11 5.08,2.56 J1.2
P28
  Top 0.152: U2.40 6.03,36.56 5.94,36.47 4.67,36.47 3.38,35.18 3.38,22.43 2.54,21.59 J3.8
P29
  Top 0.152: U2.41 6.66,36.17 4.8,36.17 3.68,35.05 3.68,21.46 J3.7
P30
  Top 0.152: U2.42 6.17,35.76 6.07,35.87 4.93,35.87 3.99,34.92 3.99,19.23 J3.6
P31
  Top 0.152: 6.66,35.36 U2.43 6.15,35.36 5.94,35.56 5.05,35.56 4.29,34.8 4.29,19.1 2.49,17.3 2.49,15.19 J3.5
SWDCLK  (via drill 0.25, 0.71)
  Top 0.152: U2.25 11.72,38.93 11.89,39.09 v12.6,39.09 | v14.07,30.96 14.07,30.94 14.43,30.58 14.43,26.31 13.79,25.68 13.79,22.55 13.31,22.07 12.6,22.07 12.22,21.69 TP2.P$1 9.12,21.69 J5.4
  Bottom 0.152: v12.6,39.09 12.6,38.61 13.13,38.08 13.13,35.48 14.73,33.88 14.73,31.65 14.07,30.99 v14.07,30.96
  other vias: 10.16,21.69
SWDIO  (via drill 0.25, 0.71)
  Top 0.152: U2.26 11.32,38.96 12.06,39.7 12.14,39.7 v12.65,40.21 | v13.41,30.96 13.41,30.94 14.12,30.23 14.12,26.44 13.49,25.81 13.49,22.68 13.18,22.38 10.72,22.38 10.64,22.45 8.38,22.45 TP1.P$1 7.62,21.46 J5.2
  Bottom 0.152: v12.65,40.21 12.12,39.67 12.12,38.89 12.29,38.71 12.29,38.48 12.83,37.95 12.83,35.36 14.43,33.76 14.43,32 13.41,30.99 v13.41,30.96 | TP1.P$1 7.62,21.46
  other vias: 7.62,21.69
VDD  (via drill 0.25)
  Top 0.152: R1.2 11.54,14.5 10.24,14.5 9.83,14.1 9.83,8.13
  Top 0.229: U2.36 7.33,38.8 7.24,38.89 v5.87,38.89 5.08,38.1 C16.1 | U2.13 13.06,33.36 | 13.06,33.36 13.96,33.36 C15.1 | U2.48 6.05,33.36 5.84,33.15 v5.84,32.26 5.84,32.09 C17.1 | v13.06,32.84 13.06,33.36
  Top 0.406: J4.3 14.82,7.2 C2.1 11.14,8.13 v10.19,8.13 | J3.3 2.03,8.13 v4.09,8.13 9.83,8.13 v10.19,8.13 | U1.5 v10.19,8.13 | 4.72,18.92 4.72,18.41 4.09,17.78 v4.09,16.51 D1.A | 4.72,18.92 4.72,27.05 v4.78,27.1 | J5.1 4.72,18.92
  Bottom 0.229: v13.06,32.84 13.06,32.33 12.85,32.13 12.19,32.13 11.94,32.38 5.97,32.38 5.87,32.28 v5.84,32.26 5.84,36.47 5.87,36.5 v5.87,38.89
  Bottom 0.406: v4.09,16.51 v4.09,8.13 | 5.87,32.28 5.61,32.03 5.61,27.94 v4.78,27.1 | v10.19,8.13 9.4,8.13 8.44,7.17 8.44,5.77 JP1.2
VIN
  Top 0.406: 8.87,5.4 8.87,7.04 8.6,7.3 U1.1 5.82,7.3 C1.1 4.66,7.2 3.81,6.35 J3.2 | 8.87,5.4 8.87,5.08 9.75,4.19 14.35,4.19 J4.2 | U1.3 8.87,5.4
XC1
  Top 0.152: U2.34 8.12,38.94 7.52,39.55 6.45,39.55 5.54,40.46 5.54,41.07 5.33,41.27 4.45,41.27 4.32,41.4 4.32,41.58 Y1.3 3.94,43.1 C9.2
XC2
  Top 0.152: U2.35 7.72,38.91 7.39,39.24 6.3,39.24 Y1.1 4.95,39.47 C10.1

### Text on the board
Bottom: v10
tPlace: nRF52832 Breakout | 16 | 15 | 17 | 14 | 18 | 13 | 19 | 12 | 20 | 11 | 22 | 10 | 23 | 09 | 24 | 08 | 25 | 1 | NFC | 2 | 05 / !A3 | 28 / !A4 | 04 / !A2 | 29 / !A5 | 03 / !A1 | 30 / !A6 | PWR | 07 | 02 / !A0 | 31 / !A7 | 01 / !X2 | !RST! | 06 | 00 / !X1 | 3V3 | 3V3 | VIN | VIN | GND | 27 / !TX | 26 / !RX | VCC | GND | GRN | BLK
bPlace: nRF52832 Breakout | http://sfe.io/t549 | 16 | 15 | 17 | 14 | 18 | 13 | 19 | 12 | 20 | 11 | 22 | 10 / !NFC2 | 23 | RTC-EN | 09 / !NFC1 | 24 | 08 | 1 | 2 | 25 | 05 / !A3 | 28 / !A4 | D | C | 04 / !A2 | 29 / !A5 | 03 / !A1 | 30 / !A6 | 02 / !A0 | PWR-LED | 31 / !A7 | 01 / !X2 | !RST! | 00 / !X1 | 3.3V | 3.3V | FTDI / VCC-EN | VIN | VIN | GND | 27 / !TX | 26 / !RX | VCC | GND
Measures: Units in inches
tDocu: Jim Lindblom